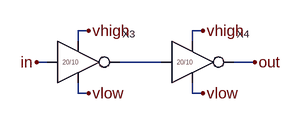
[diagram p0: schematic invBuffer.asc]
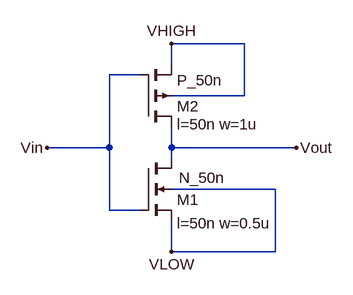
[diagram p1: sub-circuit inverter.asc]
invBuffer.asc, the LTspice schematic file:
Version 4
SHEET 1 880 680
WIRE 64 96 48 96
WIRE 240 96 224 96
WIRE 48 112 48 96
WIRE 224 112 224 96
WIRE 0 144 -16 144
WIRE 176 144 112 144
WIRE 320 144 288 144
WIRE 48 192 48 176
WIRE 64 192 48 192
WIRE 224 192 224 176
WIRE 240 192 224 192
FLAG -16 144 in
FLAG 320 144 out
FLAG 64 96 vhigh
FLAG 240 96 vhigh
FLAG 64 192 vlow
FLAG 240 192 vlow
SYMBOL Inverter 16 144 R0
SYMATTR InstName X3
SYMBOL Inverter 192 144 R0
SYMATTR InstName X4

inverter.asc, the sub-circuit schematic file:
Version 4
SHEET 1 880 680
WIRE 336 -64 224 -64
WIRE 224 -32 224 -64
WIRE 176 -16 128 -16
WIRE 336 16 336 -64
WIRE 336 16 224 16
WIRE 128 96 128 -16
WIRE 128 96 32 96
WIRE 224 96 224 64
WIRE 416 96 224 96
WIRE 224 112 224 96
WIRE 384 160 224 160
WIRE 128 192 128 96
WIRE 176 192 128 192
WIRE 224 256 224 208
WIRE 384 256 384 160
WIRE 384 256 224 256
FLAG 32 96 Vin
FLAG 224 256 VLOW
FLAG 224 -64 VHIGH
FLAG 416 96 Vout
SYMBOL nmos4 176 112 R0
WINDOW 123 56 100 Left 2
WINDOW 0 56 64 Left 2
WINDOW 3 59 30 Left 2
SYMATTR Value2 l=50n w=0.5u
SYMATTR InstName M1
SYMATTR Value N_50n
SYMBOL pmos4 176 64 M180
WINDOW 123 56 4 Left 2
SYMATTR Value2 l=50n w=1u
SYMATTR InstName M2
SYMATTR Value P_50n

The netlist it stands for:
* invBuffer.asc
XX3 vhigh vlow in N001 inverter
XX4 vhigh vlow N001 out inverter

* block symbol definitions
.subckt inverter VHIGH VLOW Vin Vout
M1 Vout Vin VLOW VLOW N_50n l=50n w=0.5u
M2 Vout Vin VHIGH VHIGH P_50n l=50n w=1u
.ends inverter

.model NMOS NMOS
.model PMOS PMOS
.lib standard.mos
.backanno
.end